# Altium schematic sheet 01_Power.SchDoc: POWER
size A4; DrawnBy: YILDIRIM_DOGRU
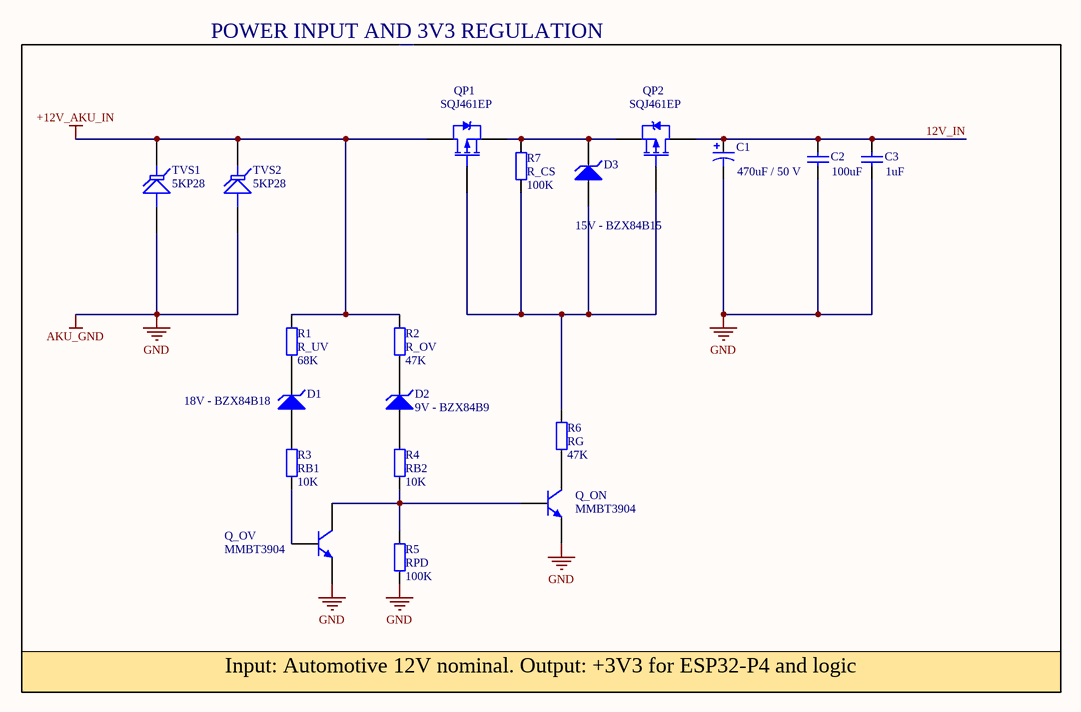
[diagram p0: 01_Power.SchDoc]

## Parts
C1  value 470uF / 50 V  [RB7.6-15]  (hidden comment: Bulk Electrolytic)
C2  value 100uF  [RAD-0.3]  (hidden comment: Cap)
C3  value 1uF  [RAD-0.3]  (hidden comment: Cap)
D1  18V - BZX84B18  [DIODE-0.7]
D2  9V - BZX84B9  [DIODE-0.7]
D3  15V - BZX84B15  [DIODE-0.7]
Q_ON  MMBT3904  [SOT-23B_L]
Q_OV  MMBT3904  [SOT-23B_L]
QP1  SQJ461EP  [SO8_L]
QP2  SQJ461EP  [SO8_L]
R1  R_UV  value 68K  [AXIAL-0.4]
R2  R_OV  value 47K  [AXIAL-0.4]
R3  RB1  value 10K  [AXIAL-0.4]
R4  RB2  value 10K  [AXIAL-0.4]
R5  RPD  value 100K  [AXIAL-0.4]
R6  RG  value 47K  [AXIAL-0.4]
R7  R_CS  value 100K  [AXIAL-0.4]
TVS1  5KP28  [DO-7]
TVS2  5KP28  [DO-7]

## Blocks framed on the sheet
POWER INPUT AND 3V3 REGULATION: C1-C3 D1-D3 Q_ON Q_OV QP1 QP2 R1-R7 TVS1 TVS2

## Nets
+12V_AKU_IN: QP1.2(D) R1.2 R2.2 TVS1.2(K) TVS2.2(K)
AKU_GND: C1.2 C2.1 C3.1 Q_ON.3(E) Q_OV.3(E) R5.1 TVS1.1(A) TVS2.1(A)  [also labelled GND]
12V_IN: C1.1 C2.2 C3.2 QP2.2(D)
NetD1_1: D1.1(A) R3.2
NetD1_2: D1.2(K) R1.1
NetD2_1: D2.1(A) R4.2
NetD2_2: D2.2(K) R2.1
NetD3_1: D3.1(A) QP1.1(G) QP2.1(G) R6.2 R7.1
NetD3_2: D3.2(K) QP1.3(S) QP2.3(S) R7.2
NetQ_ON_1: Q_ON.1(C) R6.1
NetQ_ON_2: Q_ON.2(B) Q_OV.1(C) R4.1 R5.2
NetQ_OV_2: Q_OV.2(B) R3.1

## Notes on the sheet
- Input: Automotive 12V nominal. Output: +3V3 for ESP32-P4 and logic
- Title
- Size:
- Date:
- A4
- Drawn By:
- Number:
- Revision:
- File:

## Library data of the parts
C1 = Cap Pol1: Polarized Capacitor (Radial); Published: 8-Jun-2000; LatestRevisionDate: 17-Jul-2002; LatestRevisionNote: Re-released for DXP Platform.; PackageReference: RB7.6-15; Publisher: Altium Limited; PackageDescription: Polarized Capacitor (Radial); 2 Leads
C2 C3 = Cap: Capacitor; Published: 8-Jun-2000; LatestRevisionDate: 17-Jul-2002; LatestRevisionNote: Re-released for DXP Platform.; PackageReference: RAD-0.3; Publisher: Altium Limited; PackageDescription: Radial Cap, Thru-Hole; 2 Leads; 0.3 in Pin Spacing
D1-D3 = D Zener: Zener Diode; Published: 8-Jun-2000; LatestRevisionDate: 17-Jul-2002; LatestRevisionNote: Re-released for DXP Platform.; PackageReference: DIODE-0.7; Publisher: Altium Limited; PackageDescription: Diode, Thru-Hole; 2 Leads; 0.7 in Pin Spacing
Q_ON Q_OV = QNPN: NPN Bipolar Transistor; Published: 8-Jun-2000; LatestRevisionDate: 29-May-2009; LatestRevisionNote: IPC-7351 Footprint Added.; PackageVersion: Aug-1999; PackageReference: SOT-23B; Publisher: Altium Limited; PackageDescription: 3-Pin SOT-23 Package 0.95 mm Pitch, 2.4 mm Lead Span
QP1 = PMOS-2: VDS >= 60V P-Channel Power MOSFET with body diode. Direction Aku -> CS; Note: Pin 4 not drawn and electrically connected to Pin 2.; Published: 8-Jun-2000; LatestRevisionDate: 17-Jul-2002; LatestRevisionNote: Re-released for DXP Platform.; DatasheetVersion: PD-9.390D; PackageVersion: Feb-1997; PackageReference: TO-220AB; Publisher: Altium Limited; PackageDescription: TO, Thru-Hole, Vertical, Heatsink Mounted; 3 In-Line Leads; Pitch 2.54 mm; ComponentLink1Description: Manufacturer Link; ComponentLink1URL: http://www.irf.com/
QP2 = PMOS-2: VDS >= 60V P-Channel Power MOSFET with body diode. Direction  , CS  <- DC Regulator; Note: Pin 4 not drawn and electrically connected to Pin 2.; Published: 8-Jun-2000; LatestRevisionDate: 17-Jul-2002; LatestRevisionNote: Re-released for DXP Platform.; DatasheetVersion: PD-9.390D; PackageVersion: Feb-1997; PackageReference: TO-220AB; Publisher: Altium Limited; PackageDescription: TO, Thru-Hole, Vertical, Heatsink Mounted; 3 In-Line Leads; Pitch 2.54 mm; ComponentLink1Description: Manufacturer Link; ComponentLink1URL: http://www.irf.com/
R1-R7 = Res2: Resistor; Published: 8-Jun-2000; LatestRevisionDate: 17-Jul-2002; LatestRevisionNote: Re-released for DXP Platform.; PackageReference: AXIAL-0.4; Publisher: Altium Limited; PackageDescription: Axial Device, Thru-Hole; 2 Leads; 0.4 in Pin Spacing
TVS1 = Tranzorb: 50V clamp - Transient Voltage Suppression (TVS) Diode; Published: 24-Mar-1999; LatestRevisionDate: 17-Jul-2002; LatestRevisionNote: Re-released for DXP Platform.; PackageReference: DO-7; Publisher: Altium Limited; PackageDescription: Axial Lead Diode
TVS2 = Tranzorb: 50V  clamp - Transient Voltage Suppression (TVS) Diode; Published: 24-Mar-1999; LatestRevisionDate: 17-Jul-2002; LatestRevisionNote: Re-released for DXP Platform.; PackageReference: DO-7; Publisher: Altium Limited; PackageDescription: Axial Lead Diode